# Altium schematic sheet LEM_interface.SchDoc
size A4; CompanyName: Technische Hochschule Nürnberg Georg Simon Ohm; Organization: UltraZohm; Address1: Kesslerplatz 12; Address2: 90489 Nürnberg; Address3: GERMANY; SheetNumber: 3; SheetTotal: 4; Website: www.ultrazohm.com
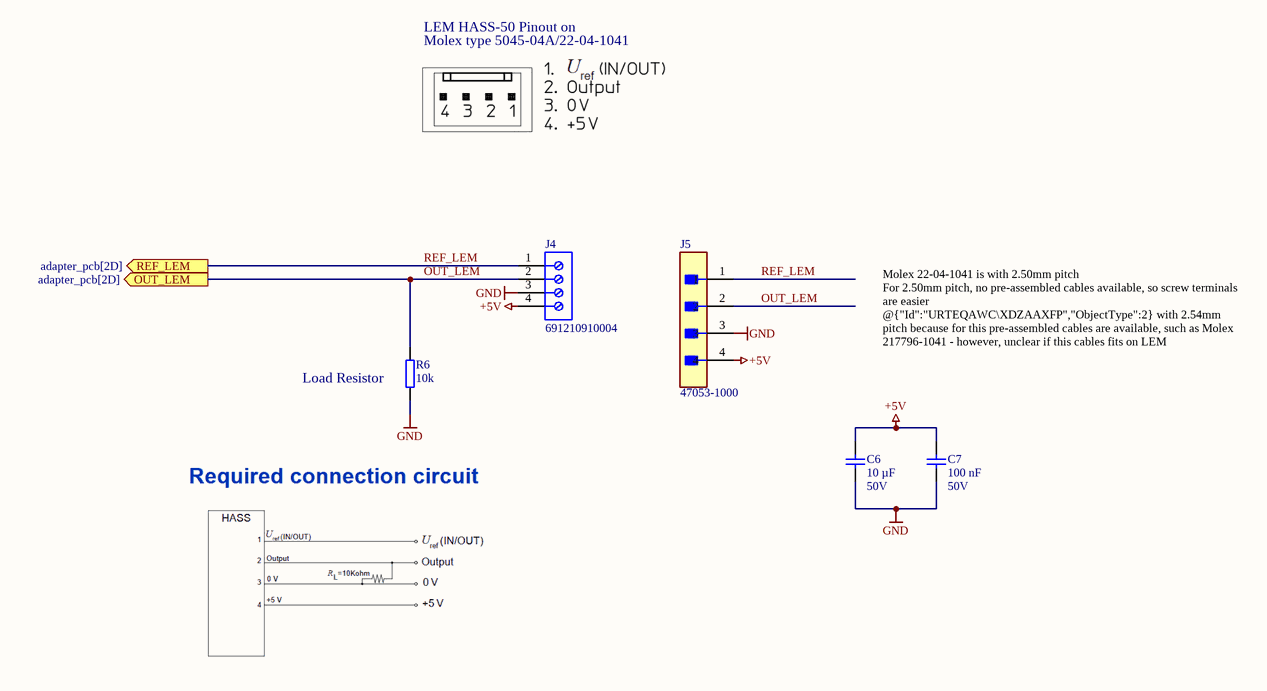
[diagram p0: LEM_interface.SchDoc]

## Parts
C6  Voltage: 50V  [C_1206_TE]  (hidden comment: 10 µF)
C7  Voltage: 50V  [C_0603_TE]  (hidden comment: 100 nF)
J4  691210910004  [691210910004]
J5  47053-1000  [FP-470531000-MFG]
R6  10k  [R_0603_TE]

## Ports
OUT_LEM (out, see adapter_pcb[2D]), REF_LEM (out, see adapter_pcb[2D])

## Nets
+5V: C6.2 C7.2 J4.4 J5.4
GND: C6.1 C7.1 J4.3 J5.3 R6.1
OUT_LEM: J4.2 J5.2 R6.2 ; port OUT_LEM
REF_LEM: J4.1 J5.1 ; port REF_LEM

## Notes on the sheet
- LEM HASS-50 Pinout on
- Molex type 5045-04A/22-04-1041
- Molex 22-04-1041 is with 2.50mm pitch
  For 2.50mm pitch, no pre-assembled cables available, so screw terminals are easier
  @{"Id":"URTEQAWC\XDZAAXFP","ObjectType":2} with 2.54mm pitch because for this pre-assembled cables are available, such as Molex  217796-1041 - however, unclear if this cables fits on LEM
- (near R6) Load Resistor
- Title
- Revision:
- Design Engineer:
- Date:
- Project:
- Sheet
- of

## Library data of the parts
C6 = UZgen_C_1206_10uF_50V_X7R: Generic capacitor; Manufacturer: UZgen; Tolerance: 10 %; Created from: MGeier; Manufacturer Part Number: UZgen_C_1206_10uF_50V_X7R; PartID: 5807; Created On: 20.03.2025 14:05:00; Value: 10 µF; Device Package: 1206; Technology: X7R; Mounting Type: SMD; Last Updated: 20.03.2025 14:05:00
C7 = UZgen_C_0603_100nF_50V_X7R: Generic capacitor; Manufacturer: UZgen; Tolerance: 10 %; Created from: AGeiger; Manufacturer Part Number: UZgen_C_0603_100nF_50V_X7R; PartID: 1; Created On: 02.07.2024 14:42:23; Value: 100 nF; Device Package: 0603; Technology: X7R; Mounting Type: SMD; Last Updated: 08.08.2024 15:01:15
J4 = CMP-1502-02458-3: Tb, Wire To Brd, R/A, 4Way, 18Awg Rohs Compliant: Yes; LCSC Part Number: C918122
J5 = CMP-04776-000290-2: CONN HEADER VERT 4POS 2.54MM; NexarPartId: 854935; Manufacturer Lifecycle Status: ACTIVE; Voltage Rating (DC): 250V; Gender: Male; Plating: Copper; Number of Positions: 4; Glow Wire Compliant: Non-compliant; Current Rating: 500mA; Max Operating Temperature: 75°C; Number of Rows: 1; REACH SVHC: Unknown; Ambient Temperature Range High: 105°C; Pitch: 2.54mm; Height: 7.7mm; Min Operating Temperature: 0°C; Packaging: Bulk; Contact Material: Brass, Copper; Contact Plating: Tin; Lead Pitch: 2.54mm; Voltage Rating: 250V; Termination: Through Hole; Radiation Hardening: No; Orientation: Vertical; Mount: Through Hole; Number of Pins: 4; Country of Origin: HK; Halogen Free: Low Halogen; Lifecycle Status: Production; Number of Circuits: 4; Schedule B: 8536694040, 8536694040; Housing Color: Beige; Housing Material: Nylon; Depth: 5.84mm; RoHS: Compliant; Length: 10.2mm; Number of Contacts: 4; LCSC Part Number: C240840
R6 = UZgen_R_0603_10k: Generic resistor; Manufacturer: UZgen; Tolerance: 1 %; Created from: AGeiger; Manufacturer Part Number: UZgen_R_0603_10k; PartID: 1; Created On: 02.07.2024 14:34:53; Value: 10k; Device Package: 0603; Mounting Type: SMD; Last Updated: 02.07.2024 14:37:16; LCSC Part Number: C25804